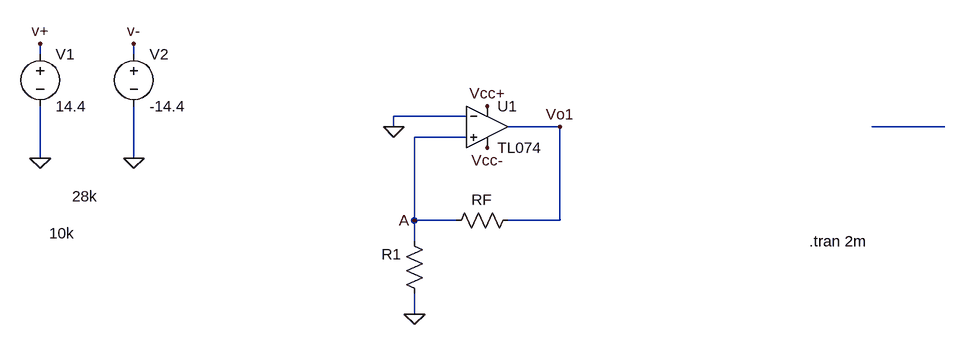
[diagram p0: schematic EsquematicoMultivibrador.asc]
EsquematicoMultivibrador.asc, the LTspice schematic file:
Version 4
SHEET 1 1140 680
WIRE -256 80 -256 64
WIRE -112 80 -112 64
WIRE 400 176 288 176
WIRE 288 192 288 176
WIRE 544 192 464 192
WIRE 1136 192 1024 192
WIRE 400 208 320 208
WIRE -256 240 -256 160
WIRE -112 240 -112 160
WIRE 320 336 320 208
WIRE 384 336 320 336
WIRE 544 336 544 192
WIRE 544 336 464 336
WIRE 320 368 320 336
WIRE 320 480 320 448
FLAG 288 192 0
FLAG 432 160 Vcc+
FLAG 432 224 Vcc-
FLAG -256 240 0
FLAG -112 240 0
FLAG -256 64 v+
FLAG -112 64 v-
FLAG 320 480 0
FLAG 544 192 Vo1
FLAG 320 336 A
SYMBOL res 480 320 R90
WINDOW 0 0 56 VBottom 2
WINDOW 3 -37 667 VTop 2
SYMATTR InstName RF
SYMATTR Value 28k
SYMBOL res 336 464 R180
WINDOW 0 36 76 Left 2
WINDOW 3 539 108 Left 2
SYMATTR InstName R1
SYMATTR Value 10k
SYMBOL voltage -256 64 R0
WINDOW 123 0 0 Left 2
WINDOW 39 0 0 Left 2
SYMATTR InstName V1
SYMATTR Value 14.4
SYMBOL voltage -112 64 R0
WINDOW 123 0 0 Left 2
WINDOW 39 0 0 Left 2
SYMATTR InstName V2
SYMATTR Value -14.4
SYMBOL Opamps/opamp2 432 128 R0
SYMATTR InstName U1
SYMATTR Value TL074
TEXT 928 368 Left 2 !.tran 2m

The netlist it stands for:
* EsquematicoMultivibrador.asc
RF Vo1 A 28k
R1 0 A 10k
V1 v+ 0 14.4
V2 v- 0 -14.4
XU1 A 0 Vcc+ Vcc- Vo1 TL074  ; pins In+ In- V+ V- OUT
.tran 2m
.backanno
.end